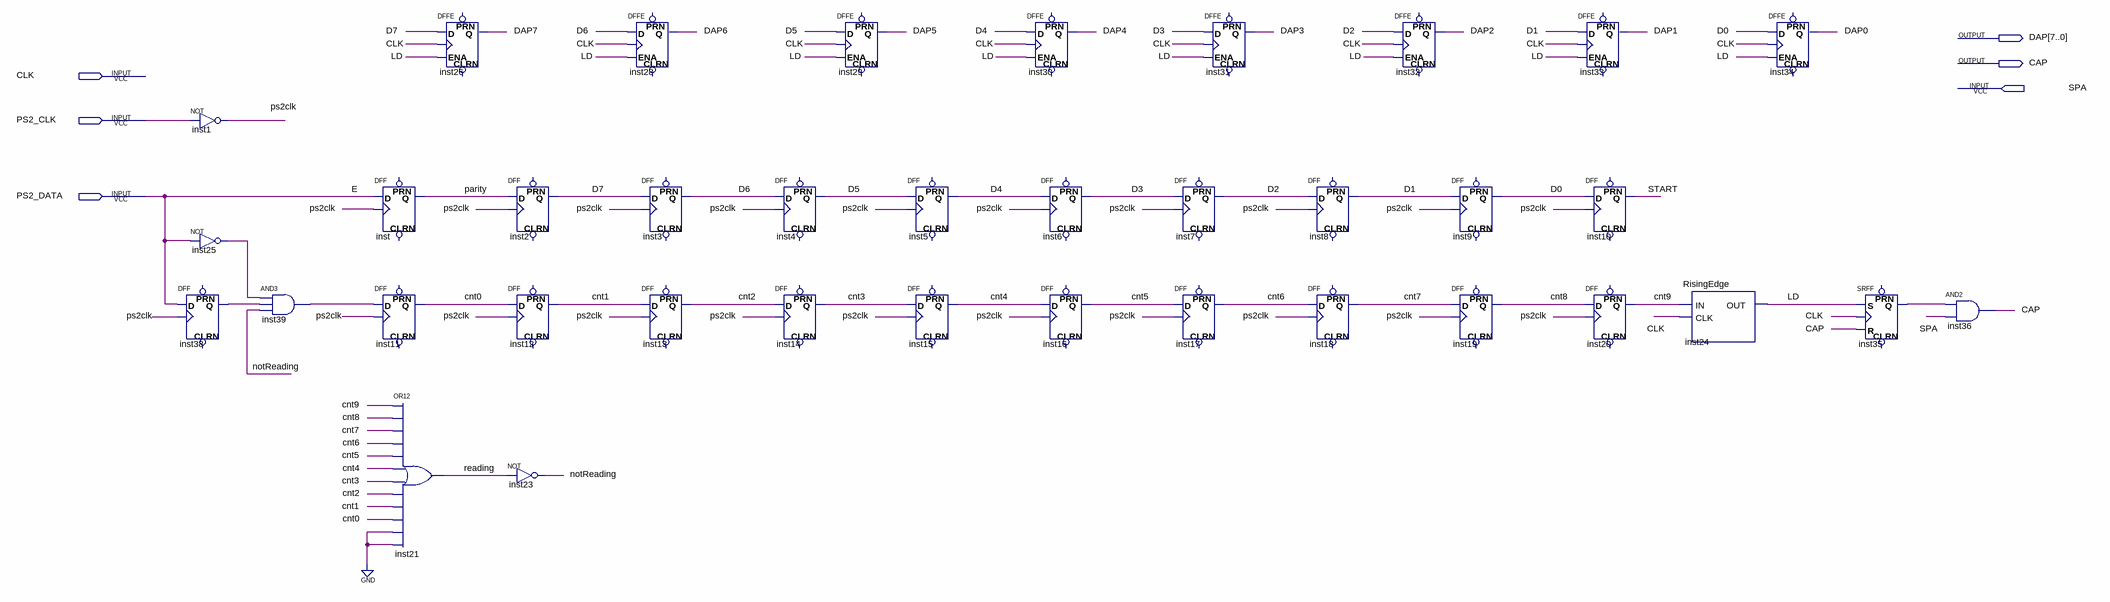
[diagram p0: schematic sheet]
// Quartus schematic UA.bdf as structural Verilog: 37 symbols, 6 pins
module UA (
  input  CLK,
  input  SPA,
  input  PS2_CLK,
  input  PS2_DATA,
  output [7:0] DAP,
  output CAP
);

  wire cnt0, cnt1, cnt2, cnt3, cnt4, cnt5, cnt6, cnt7, cnt8, cnt9, D0, D1, D2, D3, D4, D5, D6, D7,
       inst25_out, inst35_q, inst38_q, inst39_out, LD, notReading, parity, ps2clk, reading, START;

  not inst1 (ps2clk, PS2_CLK);
  not inst25 (inst25_out, PS2_DATA);
  DFF inst38 (.CLK(ps2clk), .D(PS2_DATA), .Q(inst38_q));  // open: CLRN, PRN
  and inst39 (inst39_out, inst25_out, inst38_q, notReading);
  DFF inst (.CLK(ps2clk), .D(PS2_DATA), .Q(parity));  // open: CLRN, PRN
  DFF inst11 (.CLK(ps2clk), .D(inst39_out), .Q(cnt0));  // open: CLRN, PRN
  or inst21 (reading, cnt9, cnt8, cnt7, cnt6, cnt5, cnt4, cnt3, cnt2, cnt1, cnt0, 1'b0, 1'b0);
  DFFE inst26 (.D(D7), .CLK(CLK), .ENA(LD), .Q(DAP[7]));  // open: PRN, CLRN
  DFF inst2 (.CLK(ps2clk), .D(parity), .Q(D7));  // open: CLRN, PRN
  DFF inst12 (.CLK(ps2clk), .D(cnt0), .Q(cnt1));  // open: CLRN, PRN
  not inst23 (notReading, reading);
  DFFE inst28 (.D(D6), .CLK(CLK), .ENA(LD), .Q(DAP[6]));  // open: PRN, CLRN
  DFF inst3 (.CLK(ps2clk), .D(D7), .Q(D6));  // open: CLRN, PRN
  DFF inst13 (.CLK(ps2clk), .D(cnt1), .Q(cnt2));  // open: CLRN, PRN
  DFF inst4 (.CLK(ps2clk), .D(D6), .Q(D5));  // open: CLRN, PRN
  DFF inst14 (.CLK(ps2clk), .D(cnt2), .Q(cnt3));  // open: CLRN, PRN
  DFFE inst29 (.D(D5), .CLK(CLK), .ENA(LD), .Q(DAP[5]));  // open: PRN, CLRN
  DFF inst5 (.CLK(ps2clk), .D(D5), .Q(D4));  // open: CLRN, PRN
  DFF inst15 (.CLK(ps2clk), .D(cnt3), .Q(cnt4));  // open: CLRN, PRN
  DFFE inst30 (.D(D4), .CLK(CLK), .ENA(LD), .Q(DAP[4]));  // open: PRN, CLRN
  DFF inst6 (.CLK(ps2clk), .D(D4), .Q(D3));  // open: CLRN, PRN
  DFF inst16 (.CLK(ps2clk), .D(cnt4), .Q(cnt5));  // open: CLRN, PRN
  DFF inst7 (.CLK(ps2clk), .D(D3), .Q(D2));  // open: CLRN, PRN
  DFF inst17 (.CLK(ps2clk), .D(cnt5), .Q(cnt6));  // open: CLRN, PRN
  DFFE inst31 (.D(D3), .CLK(CLK), .ENA(LD), .Q(DAP[3]));  // open: PRN, CLRN
  DFF inst8 (.CLK(ps2clk), .D(D2), .Q(D1));  // open: CLRN, PRN
  DFF inst18 (.CLK(ps2clk), .D(cnt6), .Q(cnt7));  // open: CLRN, PRN
  DFFE inst32 (.D(D2), .CLK(CLK), .ENA(LD), .Q(DAP[2]));  // open: PRN, CLRN
  DFF inst9 (.CLK(ps2clk), .D(D1), .Q(D0));  // open: CLRN, PRN
  DFF inst19 (.CLK(ps2clk), .D(cnt7), .Q(cnt8));  // open: CLRN, PRN
  DFFE inst33 (.D(D1), .CLK(CLK), .ENA(LD), .Q(DAP[1]));  // open: PRN, CLRN
  DFF inst10 (.CLK(ps2clk), .D(D0), .Q(START));  // open: CLRN, PRN
  DFF inst20 (.CLK(ps2clk), .D(cnt8), .Q(cnt9));  // open: CLRN, PRN
  RisingEdge inst24 (.IN(cnt9), .CLK(CLK), .OUT(LD));
  DFFE inst34 (.D(D0), .CLK(CLK), .ENA(LD), .Q(DAP[0]));  // open: PRN, CLRN
  SRFF inst35 (.S(LD), .R(CAP), .CLK(CLK), .Q(inst35_q));  // open: PRN, CLRN
  and inst36 (CAP, inst35_q, SPA);

  // Other names for the same wires on the sheet: E = PS2_DATA
endmodule
